# EAGLE design RPi-ILDA_v1 (EAGLE 6.4)
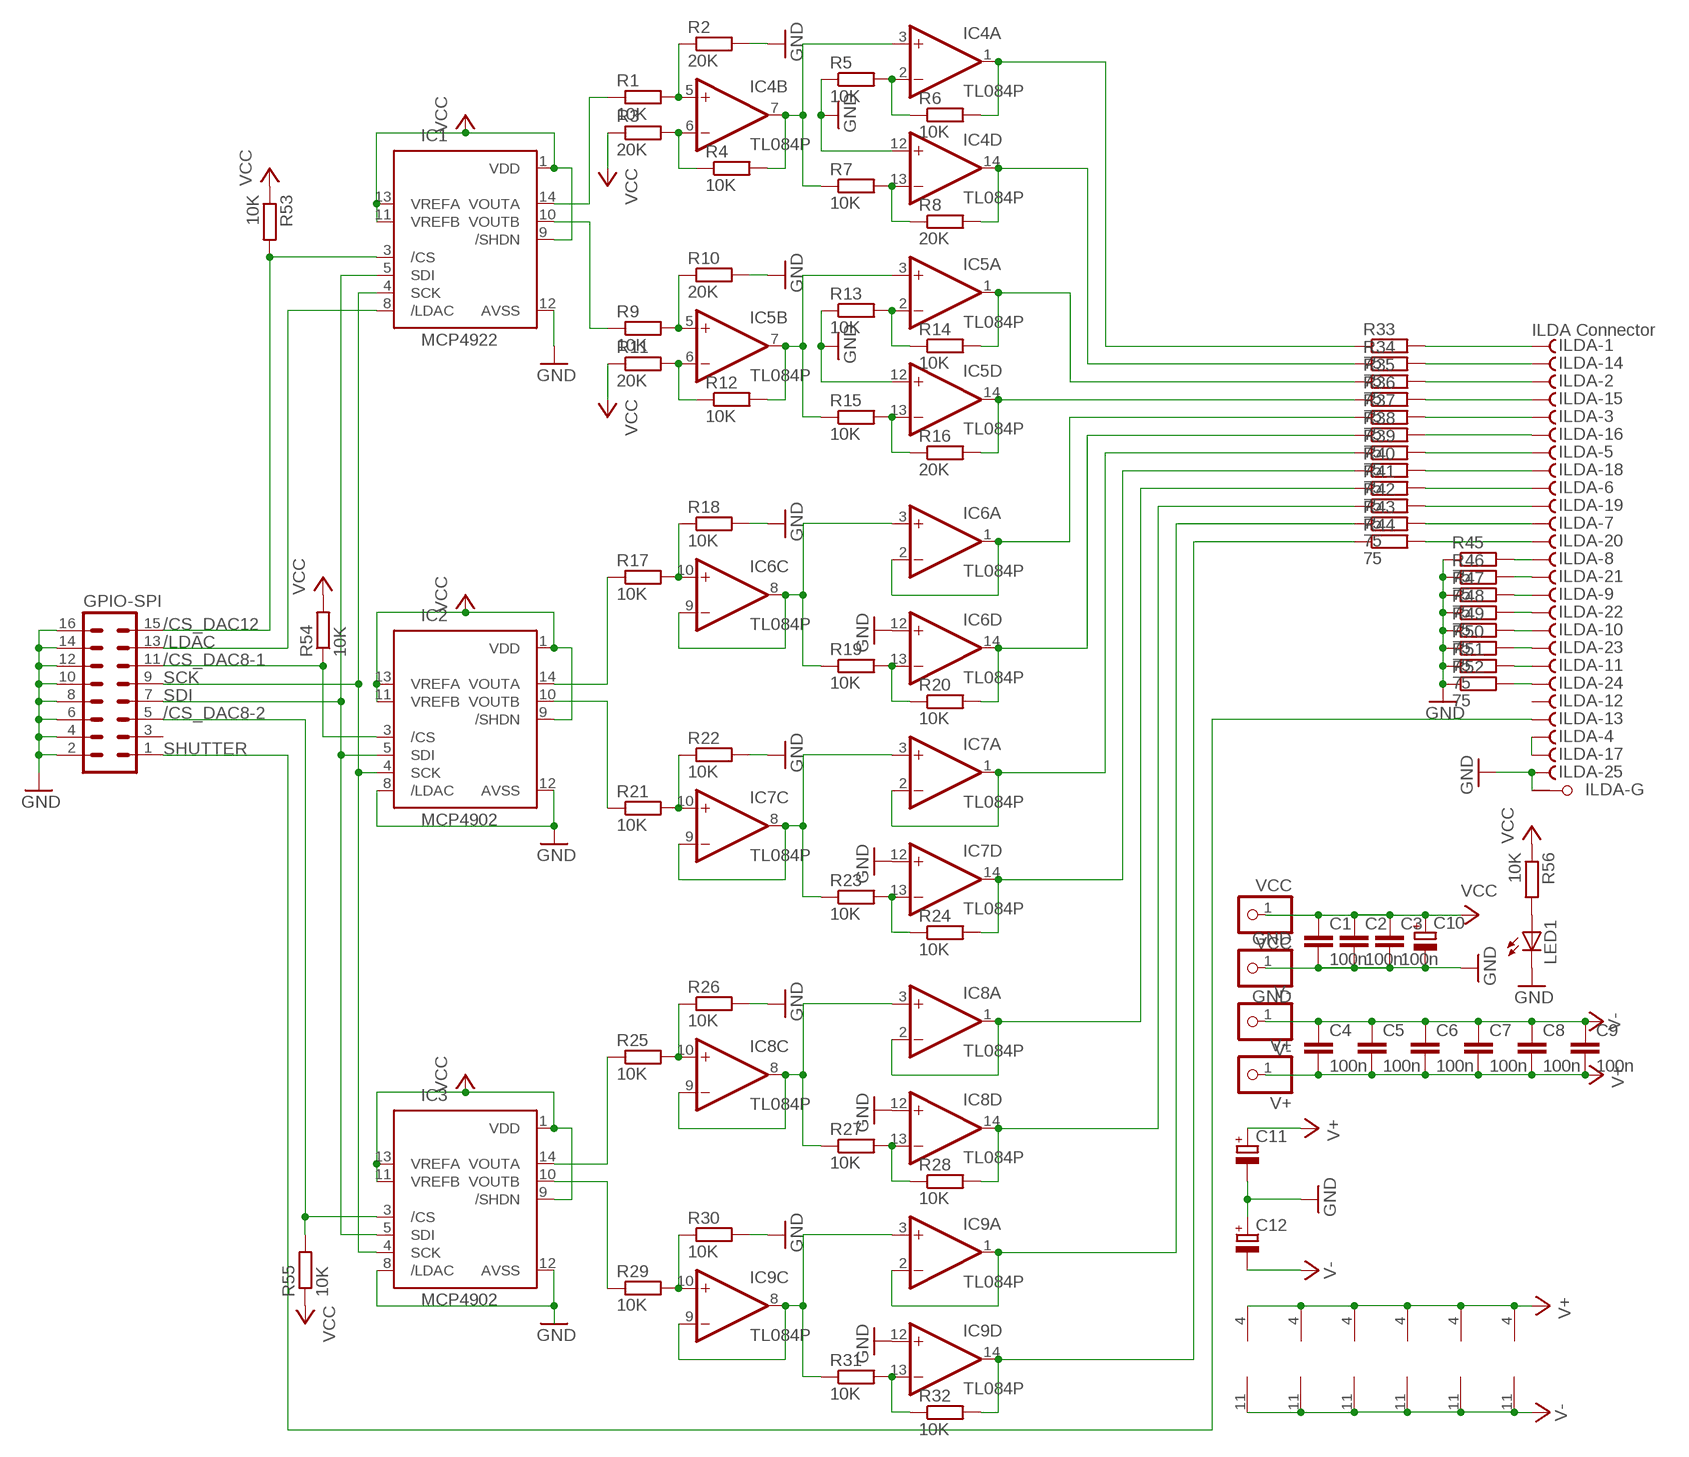
[diagram p0: schematic, sheet 1]

## Parts
C1  100n  C-EU050-024X044  [C050-024X044]
C2  100n  C-EU050-024X044  [C050-024X044]
C3  100n  C-EU050-024X044  [C050-024X044]
C4  100n  C-EU050-024X044  [C050-024X044]
C5  100n  C-EU050-024X044  [C050-024X044]
C6  100n  C-EU050-024X044  [C050-024X044]
C7  100n  C-EU050-024X044  [C050-024X044]
C8  100n  C-EU050-024X044  [C050-024X044]
C9  100n  C-EU050-024X044  [C050-024X044]
C10  CPOL-EUE5-6  [E5-6]
C11  CPOL-EUE5-6  [E5-6]
C12  CPOL-EUE5-6  [E5-6]
GND  GND  PINHD-1X1  [1X01]
GPIO-SPI  MA08-2  [MA08-2]
IC1  MCP4922  [DIL14]
IC2  MCP4902  MCP4922  [DIL14]
IC3  MCP4902  MCP4922  [DIL14]
IC4  TL084P  [DIL14]
IC5  TL084P  [DIL14]
IC6  TL084P  [DIL14]
IC7  TL084P  [DIL14]
IC8  TL084P  [DIL14]
IC9  TL084P  [DIL14]
ILDA  ILDA Connector  F25HPS  [F25HP]
LED1  LED3MM  [LED3MM]
R1  10K  R-EU_0204/5  [0204/5]
R2  20K  R-EU_0204/2V  [0204V]
R3  20K  R-EU_0204/5  [0204/5]
R4  10K  R-EU_0204/2V  [0204V]
R5  10K  R-EU_0204/2V  [0204V]
R6  10K  R-EU_0204/2V  [0204V]
R7  10K  R-EU_0204/5  [0204/5]
R8  20K  R-EU_0204/2V  [0204V]
R9  10K  R-EU_0204/5  [0204/5]
R10  20K  R-EU_0204/2V  [0204V]
R11  20K  R-EU_0204/5  [0204/5]
R12  10K  R-EU_0204/2V  [0204V]
R13  10K  R-EU_0204/2V  [0204V]
R14  10K  R-EU_0204/2V  [0204V]
R15  10K  R-EU_0204/5  [0204/5]
R16  20K  R-EU_0204/2V  [0204V]
R17  10K  R-EU_0204/5  [0204/5]
R18  10K  R-EU_0204/2V  [0204V]
R19  10K  R-EU_0204/2V  [0204V]
R20  10K  R-EU_0204/2V  [0204V]
R21  10K  R-EU_0204/5  [0204/5]
R22  10K  R-EU_0204/5  [0204/5]
R23  10K  R-EU_0204/2V  [0204V]
R24  10K  R-EU_0204/2V  [0204V]
R25  10K  R-EU_0204/5  [0204/5]
R26  10K  R-EU_0204/2V  [0204V]
R27  10K  R-EU_0204/2V  [0204V]
R28  10K  R-EU_0204/2V  [0204V]
R29  10K  R-EU_0204/5  [0204/5]
R30  10K  R-EU_0204/5  [0204/5]
R31  10K  R-EU_0204/2V  [0204V]
R32  10K  R-EU_0204/2V  [0204V]
R33  75  R-EU_0204/2V  [0204V]
R34  75  R-EU_0204/2V  [0204V]
R35  75  R-EU_0204/2V  [0204V]
R36  75  R-EU_0204/2V  [0204V]
R37  75  R-EU_0204/2V  [0204V]
R38  75  R-EU_0204/2V  [0204V]
R39  75  R-EU_0204/2V  [0204V]
R40  75  R-EU_0204/2V  [0204V]
R41  75  R-EU_0204/2V  [0204V]
R42  75  R-EU_0204/2V  [0204V]
R43  75  R-EU_0204/2V  [0204V]
R44  75  R-EU_0204/2V  [0204V]
R45  75  R-EU_0204/2V  [0204V]
R46  75  R-EU_0204/2V  [0204V]
R47  75  R-EU_0204/2V  [0204V]
R48  75  R-EU_0204/2V  [0204V]
R49  75  R-EU_0204/2V  [0204V]
R50  75  R-EU_0204/2V  [0204V]
R51  75  R-EU_0204/2V  [0204V]
R52  75  R-EU_0204/2V  [0204V]
R53  10K  R-EU_0204/5  [0204/5]
R54  10K  R-EU_0204/5  [0204/5]
R55  10K  R-EU_0204/5  [0204/5]
R56  10K  R-EU_0204/2V  [0204V]
V+  V+  PINHD-1X1  [1X01]
V-  V-  PINHD-1X1  [1X01]
VCC  VCC  PINHD-1X1  [1X01]

## Nets
/CS_DAC8-1: GPIO-SPI.11 IC2.3(/CS) R54.1
/CS_DAC8-2: GPIO-SPI.5 IC3.3(/CS) R55.2
/CS_DAC12: GPIO-SPI.15 IC1.3(/CS) R53.2
/LDAC: GPIO-SPI.13 IC1.8(/LDAC)
GND: C1.2 C2.2 C3.2 C10.- C11.- C12.+ GND.1 GPIO-SPI.2 GPIO-SPI.4 GPIO-SPI.6 GPIO-SPI.8 GPIO-SPI.10 GPIO-SPI.12 GPIO-SPI.14 GPIO-SPI.16 IC1.12(AVSS) IC2.8(/LDAC) IC2.12(AVSS) IC3.8(/LDAC) IC3.12(AVSS) IC4.12(D:+IN) IC5.12(D:+IN) IC6.12(D:+IN) IC7.12(D:+IN) IC8.12(D:+IN) IC9.12(D:+IN) ILDA.25(-25:F) ILDA.G1(-G:G1) LED1.K(C) R2.2 R5.1 R10.2 R13.1 R18.2 R22.2 R26.2 R30.2 R45.1 R46.1 R47.1 R48.1 R49.1 R50.1 R51.1 R52.1
N$1: LED1.A R56.2
N$2: ILDA.3(-3:F) R37.2
N$3: IC4.2(A:-IN) R5.2 R6.1
N$4: IC5.2(A:-IN) R13.2 R14.1
N$5: IC5.13(D:-IN) R15.2 R16.1
N$6: IC3.14(VOUTA) R25.1
N$7: IC7.14(D:OUT) R24.2 R40.1
N$8: IC7.13(D:-IN) R23.2 R24.1
N$9: IC7.10(C:+IN) R21.2 R22.1
N$10: ILDA.4(-4:F) ILDA.17(-17:F)
N$11: IC7.3(A:+IN) IC7.8(C:OUT) IC7.9(C:-IN) R23.1
N$12: IC7.1(A:OUT) IC7.2(A:-IN) R39.1
N$15: ILDA.5(-5:F) R39.2
N$16: IC1.14(VOUTA) R1.1
N$17: IC1.10(VOUTB) R9.1
N$18: ILDA.18(-18:F) R40.2
N$20: IC6.14(D:OUT) R20.2 R38.1
N$21: IC4.13(D:-IN) R7.2 R8.1
N$22: IC6.13(D:-IN) R19.2 R20.1
N$23: IC8.14(D:OUT) R28.2 R42.1
N$24: IC6.10(C:+IN) R17.2 R18.1
N$25: IC6.3(A:+IN) IC6.8(C:OUT) IC6.9(C:-IN) R19.1
N$26: IC6.1(A:OUT) IC6.2(A:-IN) R37.1
N$27: IC8.13(D:-IN) R27.2 R28.1
N$28: IC8.10(C:+IN) R25.2 R26.1
N$29: IC8.3(A:+IN) IC8.8(C:OUT) IC8.9(C:-IN) R27.1
N$30: IC8.1(A:OUT) IC8.2(A:-IN) R41.1
N$33: ILDA.8(-8:F) R45.2
N$34: ILDA.6(-6:F) R41.2
N$35: ILDA.16(-16:F) R38.2
N$37: IC5.14(D:OUT) R16.2 R36.1
N$38: ILDA.19(-19:F) R42.2
N$39: IC5.1(A:OUT) R14.2 R35.1
N$40: IC9.14(D:OUT) R32.2 R44.1
N$41: IC9.13(D:-IN) R31.2 R32.1
N$42: IC9.10(C:+IN) R29.2 R30.1
N$43: IC9.3(A:+IN) IC9.8(C:OUT) IC9.9(C:-IN) R31.1
N$44: IC9.1(A:OUT) IC9.2(A:-IN) R43.1
N$45: IC3.10(VOUTB) R29.1
N$47: IC4.14(D:OUT) R8.2 R34.1
N$48: IC4.1(A:OUT) R6.2 R33.1
N$49: IC5.3(A:+IN) IC5.7(B:OUT) R12.2 R15.1
N$50: IC4.6(B:-IN) R3.2 R4.1
N$51: IC5.6(B:-IN) R11.2 R12.1
N$52: ILDA.7(-7:F) R43.2
N$53: ILDA.20(-20:F) R44.2
N$54: ILDA.21(-21:F) R46.2
N$55: ILDA.9(-9:F) R47.2
N$56: ILDA.22(-22:F) R48.2
N$57: ILDA.10(-10:F) R49.2
N$58: ILDA.23(-23:F) R50.2
N$59: IC2.14(VOUTA) R17.1
N$60: ILDA.11(-11:F) R51.2
N$61: ILDA.24(-24:F) R52.2
N$62: IC2.10(VOUTB) R21.1
N$63: IC5.5(B:+IN) R9.2 R10.1
N$64: IC4.5(B:+IN) R1.2 R2.1
N$85: IC4.3(A:+IN) IC4.7(B:OUT) R4.2 R7.1
N$91: ILDA.1(-1:F) R33.2
N$92: ILDA.14(-14:F) R34.2
N$93: ILDA.15(-15:F) R36.2
N$94: ILDA.2(-2:F) R35.2
SCK: GPIO-SPI.9 IC1.4(SCK) IC2.4(SCK) IC3.4(SCK)
SDI: GPIO-SPI.7 IC1.5(SDI) IC2.5(SDI) IC3.5(SDI)
SHUTTER: GPIO-SPI.1 ILDA.13(-13:F)
V+: C4.2 C5.2 C6.2 C7.2 C8.2 C9.2 C11.+ IC4.4(P:V+) IC5.4(P:V+) IC6.4(P:V+) IC7.4(P:V+) IC8.4(P:V+) IC9.4(P:V+) V+.1
V-: C4.1 C5.1 C6.1 C7.1 C8.1 C9.1 C12.- IC4.11(P:V-) IC5.11(P:V-) IC6.11(P:V-) IC7.11(P:V-) IC8.11(P:V-) IC9.11(P:V-) V-.1
VCC: C1.1 C2.1 C3.1 C10.+ IC1.1(VDD) IC1.9(/SHDN) IC1.11(VREFB) IC1.13(VREFA) IC2.1(VDD) IC2.9(/SHDN) IC2.11(VREFB) IC2.13(VREFA) IC3.1(VDD) IC3.9(/SHDN) IC3.11(VREFB) IC3.13(VREFA) R3.1 R11.1 R53.1 R54.2 R55.1 R56.1 VCC.1
Unconnected: GPIO-SPI.3 IC4.8(C:OUT) IC4.9(C:-IN) IC4.10(C:+IN) IC5.8(C:OUT) IC5.9(C:-IN) IC5.10(C:+IN) IC6.5(B:+IN) IC6.6(B:-IN) IC6.7(B:OUT) IC7.5(B:+IN) IC7.6(B:-IN) IC7.7(B:OUT) IC8.5(B:+IN) IC8.6(B:-IN) IC8.7(B:OUT) IC9.5(B:+IN) IC9.6(B:-IN) IC9.7(B:OUT) ILDA.12(-12:F) ILDA.G2(-G:G2)

## Library data of the parts
C1-C9 = rcl:C-EU: CAPACITOR, European symbol
C10-C12 = rcl:CPOL-EU: POLARIZED CAPACITOR, European symbol
GND V+ V- VCC = pinhead:PINHD-1X1: PIN HEADER
GPIO-SPI = con-lstb:MA08-2: PIN HEADER; OC_FARNELL: unknown; OC_NEWARK: unknown
IC1-IC3 = Peripherals:MCP4922: 12-Bit DAC with SPI Interface
IC4-IC9 = linear:TL084: OP AMP
ILDA = con-subd:F25HPS: SUB-D; OC_FARNELL: unknown; OC_NEWARK: unknown
LED1 = led:LED: LED OSRAM: - CHIPLED LG R971, LG N971, LY N971, LG Q971, LY Q971, LO R971, LY R971 LH N974, LH R974 LS Q976, LO Q976, LY Q976 LO Q996 - Hyper CHIPLED LW Q18S LB Q993, LB Q99A, LB R99A - SideLED LS A670, LO A670, LY A670, LG A670, LP A670 LB A673, LV A673, LT A673, LW A673 LH A674 LY A675 LS A676, LA A676, LO A676, LY A676, LW A676 LS A679, LY A679, LG A679 - Hyper Micro SIDELED® LS Y876, LA Y876, LO Y876, LY Y876 LT Y87S - SmartLED LW L88C, LW L88S LB L89C, LB L89S, LG L890 LS L89K, LO L89K, LY L89K LS L896, LA L896, LO L896, LY L896 - TOPLED LS T670, LO T670, LY T670, LG T670, LP T670 LSG T670, LSP T670, LSY T670, LOP T670, LYG T670 LG T671, LOG T671, LSG T671 LB T673, LV T673, LT T673, LW T673 LH T674 LS T676, LA T676, LO T676, LY T676, LB T676, LH T676, LSB T676, LW T676 LB T67C, LV T67C, LT T67C, LS T67K, LO T67K, LY T67K, LW E67C LS E67B, LA E67B, LO E67B, LY E67B, LB E67C, LV E67C, LT E67C LW T67C LS T679, LY T679, LG T679 LS T770, LO T770, LY T770, LG T770, LP T770 LB T773, LV T773, LT T773, LW T773 LH T774 LS E675, LA E675, LY E675, LS T675 LS T776, LA T776, LO T776, LY T776, LB T776 LHGB T686 LT T68C, LB T68C - Hyper Mini TOPLED® LB M676 - Mini TOPLED Santana® LG M470 LS M47K, LO M47K, LY M47K Source: http://www.osram.convergy.de LUXEON: - LUMILED® LXK2-PW12-R00, LXK2-PW12-S00, LXK2-PW14-U00, LXK2-PW14-V00 LXK2-PM12-R00, LXK2-PM12-S00, LXK2-PM14-U00 LXK2-PE12-Q00, LXK2-PE12-R00, LXK2-PE12-S00, LXK2-PE14-T00, LXK2-PE14-U00 LXK2-PB12-K00, LXK2-PB12-L00, LXK2-PB12-M00, LXK2-PB14-N00, LXK2-PB14-P00, LXK2-PB14-Q00 LXK2-PR12-L00, LXK2-PR12-M00, LXK2-PR14-Q00, LXK2-PR14-R00 LXK2-PD12-Q00, LXK2-PD12-R00, LXK2-PD12-S00 LXK2-PH12-R00, LXK2-PH12-S00 LXK2-PL12-P00, LXK2-PL12-Q00, LXK2-PL12-R00 Source: www.luxeon.com KINGBRIGHT: KA-3528ASYC Source: www.kingbright.com
R1-R56 = resistor:R-EU_: RESISTOR, European symbol

## Board
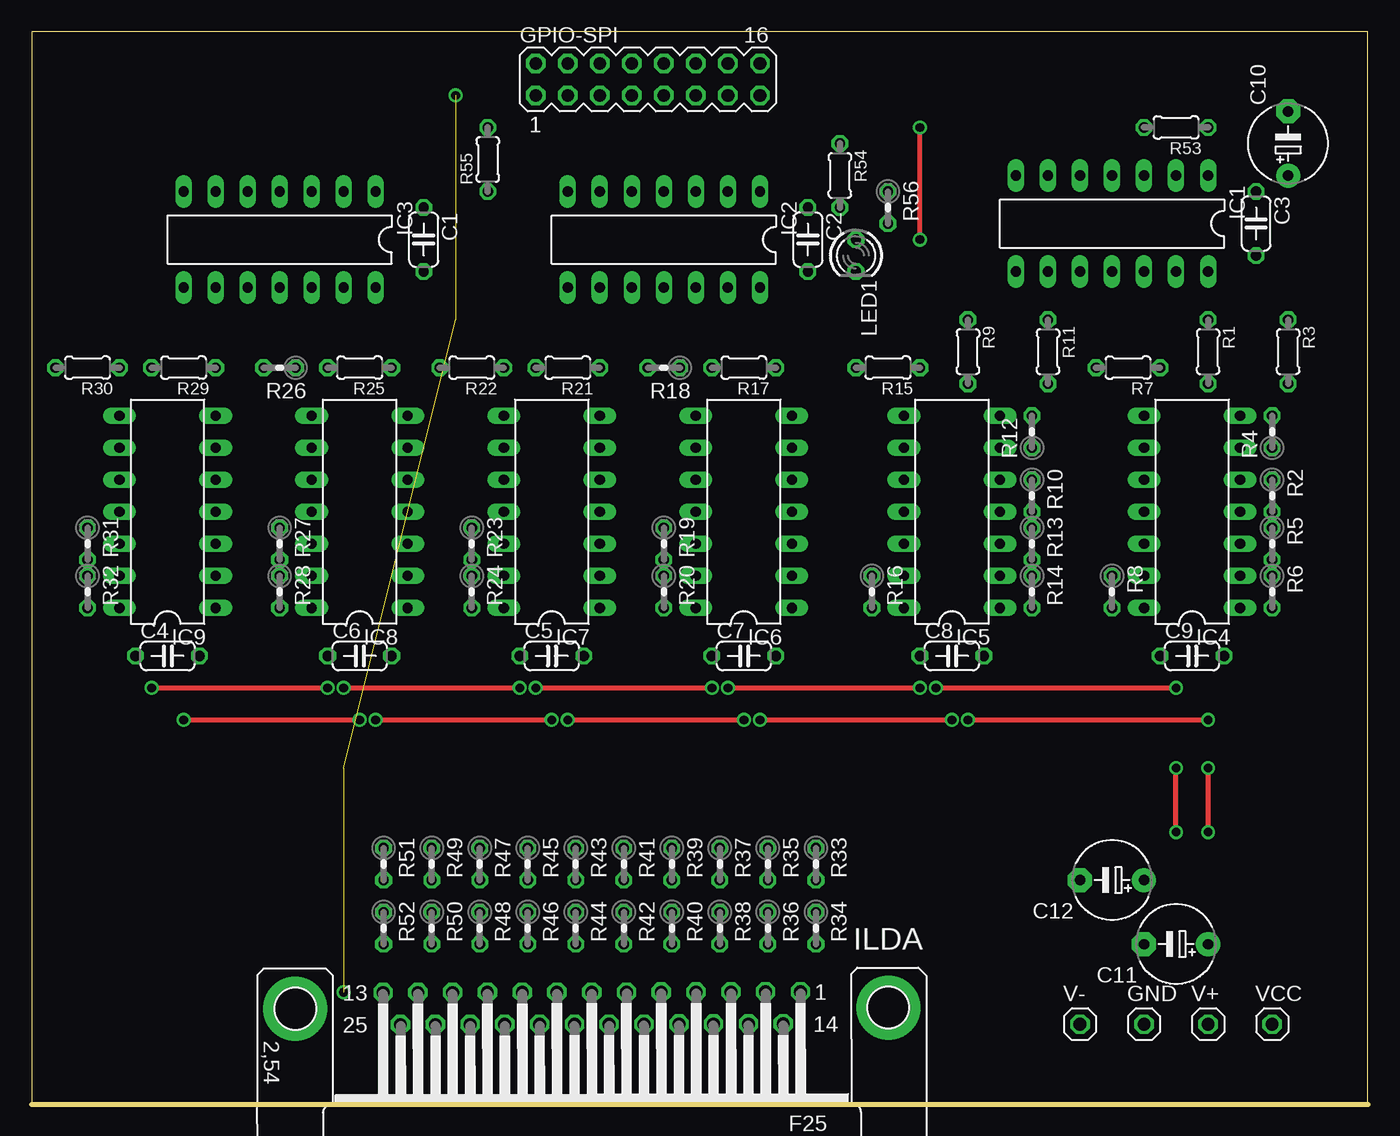
[diagram p1: board, top side]
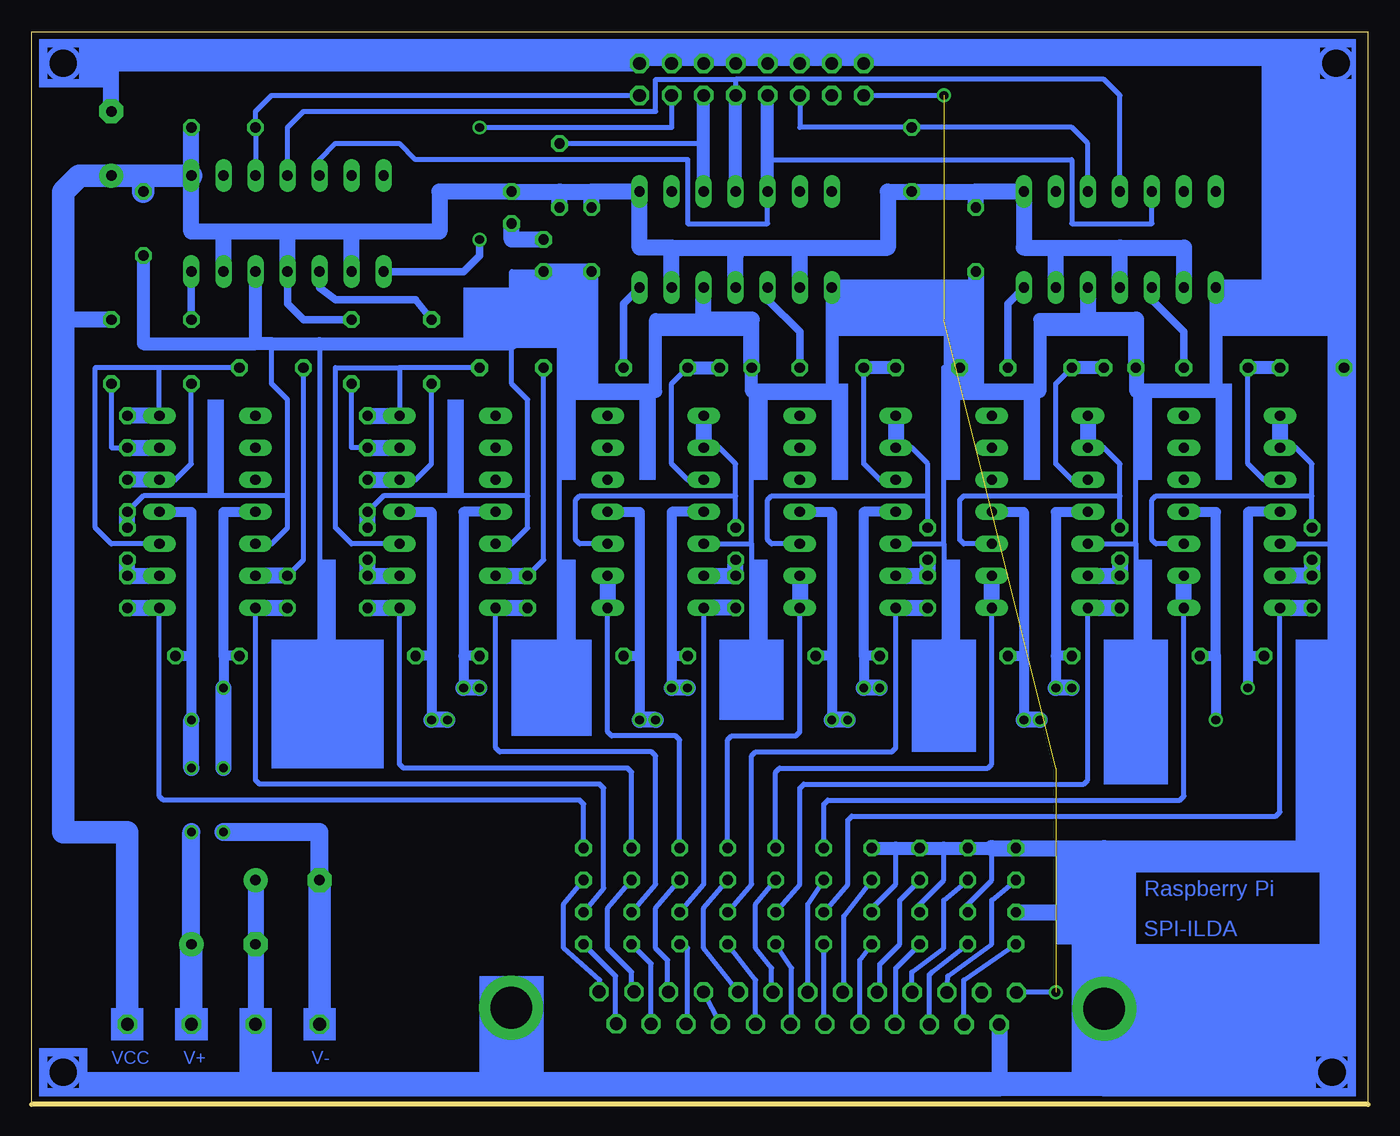
[diagram p2: board, bottom side, seen from below]

Size 106.03 x 85.08 mm. Coordinates in mm from the lower left corner, seen from the top.
Outline: 0,0 106.03,0 106.03,85.08 0,85.08 0,0
Copper layers (1*16): Top 0.035mm / dielectric 1.5mm / Bottom 0.035mm
Design rules "default": minimum track width 10mil, minimum drill 24mil, track to track 8mil, track to pad 8mil, pad to pad 8mil, via to via 8mil, smd to smd 8mil, copper to edge 40mil, drill to drill 8mil, minimum pad ring 10mil, minimum via ring 8mil, stop-mask expansion 4mil, vias tented up to drill 0mil, thermal gap 10mil

### Footprints (pad centres in the part's own frame; a part is rotated, then mirrored left to right if it is on the bottom)
C050-024X044 = drill 0.813 octagon: 1 -2.54,0; 2 2.54,0
E5-6 = drill 0.813 pad 1.905: + -2.54,0 | drill 0.813 pad 1.905 octagon: - 2.54,0
1X01 = drill 1.016 octagon: 1 0,0
MA08-2 = drill 1.016 octagon: 1 -8.89,-1.27; 2 -8.89,1.27; 3 -6.35,-1.27; 4 -6.35,1.27; 5 -3.81,-1.27; 6 -3.81,1.27; 7 -1.27,-1.27; 8 -1.27,1.27; 9 1.27,-1.27; 10 1.27,1.27; 11 3.81,-1.27; 12 3.81,1.27; 13 6.35,-1.27; 14 6.35,1.27; 15 8.89,-1.27; 16 8.89,1.27
DIL14 = drill 0.813 long: 1 -7.62,-3.81; 2 -5.08,-3.81; 3 -2.54,-3.81; 4 0,-3.81; 5 2.54,-3.81; 6 5.08,-3.81; 7 7.62,-3.81; 8 7.62,3.81; 9 5.08,3.81; 10 2.54,3.81; 11 0,3.81; 12 -2.54,3.81; 13 -5.08,3.81; 14 -7.62,3.81
F25HP = drill 1.016 octagon: 1 -16.561,-1.27; 2 -13.792,-1.27; 3 -11.049,-1.27; 4 -8.28,-1.27; 5 -5.512,-1.27; 6 -2.769,-1.27; 7 0,-1.27; 8 2.769,-1.27; 9 5.512,-1.27; 10 8.28,-1.27; 11 11.049,-1.27; 12 13.792,-1.27; 13 16.561,-1.27; 14 -15.189,1.27; 15 -12.421,1.27; 16 -9.652,1.27; 17 -6.909,1.27; 18 -4.14,1.27; 19 -1.372,1.27; 20 1.372,1.27; 21 4.14,1.27; 22 6.909,1.27; 23 9.652,1.27; 24 12.421,1.27; 25 15.189,1.27 | drill 3.302 pad 5.08: G1 -23.52,0; G2 23.52,0
LED3MM = drill 0.813 octagon: A -1.27,0; K 1.27,0
0204/5 = drill 0.813 octagon: 1 -2.54,0; 2 2.54,0
0204V = drill 0.813 octagon: 1 -1.27,0; 2 1.27,0

### Placement (x,y rotation side)
C1  31.12,68.58 270 top
C2  61.59,68.58 270 top
C3  97.16,69.85 270 top
C4  10.79,35.56 0 top
C5  41.27,35.56 0 top
C6  26.04,35.56 0 top
C7  56.52,35.56 0 top
C8  73.03,35.56 0 top
C9  92.08,35.56 0 top
C10  99.69,76.2 90 top
C11  90.8,12.7 180 top
C12  85.72,17.78 180 top
GND  88.27,6.35 0 top
GPIO-SPI  48.89,81.28 0 top
IC1  85.72,69.85 180 top
IC2  50.16,68.58 180 top
IC3  19.68,68.58 180 top
IC4  92.08,46.99 90 top
IC5  73.03,46.99 90 top
IC6  56.52,46.99 90 top
IC7  41.27,46.99 90 top
IC8  26.04,46.99 90 top
IC9  10.79,46.99 90 top
ILDA  44.45,7.62 180.1 top
LED1  65.41,67.31 270 top
R1  93.34,59.69 270 top
R2  98.42,48.26 270 top
R3  99.69,59.69 270 top
R4  98.42,53.34 90 top
R5  98.42,44.45 270 top
R6  98.42,40.64 270 top
R7  87,58.42 180 top
R8  85.72,40.64 270 top
R9  74.3,59.69 270 top
R10  79.38,48.26 270 top
R11  80.64,59.69 270 top
R12  79.38,53.34 90 top
R13  79.38,44.45 270 top
R14  79.38,40.64 270 top
R15  67.94,58.42 180 top
R16  66.67,40.64 270 top
R17  56.52,58.42 180 top
R18  50.16,58.42 180 top
R19  50.16,44.45 270 top
R20  50.16,40.64 270 top
R21  42.55,58.42 180 top
R22  34.92,58.42 180 top
R23  34.92,44.45 270 top
R24  34.92,40.64 270 top
R25  26.04,58.42 180 top
R26  19.68,58.42 180 top
R27  19.68,44.45 270 top
R28  19.68,40.64 270 top
R29  12.07,58.42 180 top
R30  4.44,58.42 180 top
R31  4.44,44.45 270 top
R32  4.44,40.64 270 top
R33  62.23,19.05 270 top
R34  62.23,13.97 270 top
R35  58.42,19.05 270 top
R36  58.42,13.97 270 top
R37  54.61,19.05 270 top
R38  54.61,13.97 270 top
R39  50.8,19.05 270 top
R40  50.8,13.97 270 top
R41  46.99,19.05 270 top
R42  46.99,13.97 270 top
R43  43.18,19.05 270 top
R44  43.18,13.97 270 top
R45  39.37,19.05 270 top
R46  39.37,13.97 270 top
R47  35.56,19.05 270 top
R48  35.56,13.97 270 top
R49  31.75,19.05 270 top
R50  31.75,13.97 270 top
R51  27.94,19.05 270 top
R52  27.94,13.97 270 top
R53  90.8,77.47 180 top
R54  64.14,73.66 270 top
R55  36.2,74.93 90 top
R56  67.94,71.12 270 top
V+  93.34,6.35 0 top
V-  83.19,6.35 0 top
VCC  98.42,6.35 0 top

### Tracks (layer width: path | path; a pad name or v marks a point on that pad's centre or on a via)
/CS_DAC8-1
  Bottom 0.406: R54.1 52.7,76.2 GPIO-SPI.11
  Bottom 1.016: IC2.3 GPIO-SPI.11
/CS_DAC8-2
  Bottom 0.406: GPIO-SPI.5 45.09,77.47 R55.2 23.49,77.47 22.22,76.2 IC3.3
/CS_DAC12
  Bottom 0.406: IC1.3 R53.2 88.27,78.74 87,80.01 GPIO-SPI.15
/LDAC  (via drill 0.7)
  Top 0.406: v70.48,68.58 v70.48,77.47
  Bottom 0.406: GPIO-SPI.13 55.24,77.47 v70.48,77.47
  Bottom 0.61: IC1.8 71.75,66.04 70.48,67.31 v70.48,68.58
GND
  Bottom 0.406: R46.1 39.37,15.56 37.46,17.46 37.46,20.32 20.95,20.32 | R48.1 35.56,15.88 33.66,17.78 33.66,20.32 | R50.1 31.75,15.88 29.84,17.78 29.84,20.32 | 10.79,64.77 IC3.8 | 3.17,44.45 IC9.12 1.91,44.45 | IC8.12 18.41,44.45 | 18.41,44.45 R26.2 | IC7.12 33.66,44.45 | IC6.12 48.89,44.45 | 48.89,44.45 48.89,56.52 | IC5.12 67.94,44.45 66.67,45.72 66.67,48.26 | 66.67,48.26 78.11,48.26 R10.2 | 66.67,48.26 66.67,55.88 67.94,57.15 67.94,60.33 67.94,66.04 LED1.K | IC4.12 87,44.45 85.72,45.72 85.72,48.26 | 85.72,48.26 97.16,48.26 R2.2 | 85.72,48.26 85.72,55.88 87,57.15 87,60.33 | GPIO-SPI.16 GPIO-SPI.14 GPIO-SPI.12 GPIO-SPI.10 GPIO-SPI.8 GPIO-SPI.6 GPIO-SPI.4 GPIO-SPI.2 | 99.69,82.55 8.26,82.55 8.26,64.77 | 18.41,44.45 18.41,36.83 | 33.66,44.45 33.66,36.83 | 48.89,44.45 48.89,36.83 | 64.14,36.83 64.14,66.04 | 83.19,60.33 83.19,36.83 | 33.66,44.45 33.66,58.42 R22.2
  Bottom 1.016: R45.1 37.46,20.32 R47.1 33.66,20.32 R49.1 29.84,20.32 R51.1 | IC2.8 42.55,56.52 48.89,56.52 R18.2 | IC3.8 12.07,56.52 18.41,56.52 R26.2 | 22.22,62.23 26.04,62.23 26.04,56.52 31.12,56.52 31.12,58.42 | C2.2 61.59,56.52 56.52,56.52 56.52,62.23 52.07,62.23 | C3.2 97.16,60.33 88.27,60.33 | 88.27,60.33 IC1.12 | 67.94,60.33 83.19,60.33 87,60.33 88.27,60.33
  Bottom 1.27: R5.1 R2.2 | R13.1 R10.2 | ILDA.25 29.26,1.27 | 20.95,15.24 20.95,1.27 29.26,1.27 | IC3.8 8.26,64.77 1.91,64.77 R30.2 1.91,44.45 1.91,21.59 3.17,20.32 20.95,20.32 | IC3.12 22.22,62.23 18.41,62.23 R26.2 | C1.2 31.12,64.77 | 31.12,64.77 31.12,58.42 R22.2 | 31.12,64.77 IC2.8 | R18.2 48.89,62.23 52.07,62.23 52.7,62.23 IC2.12 | C2.2 64.14,66.04 LED1.K | C10.- 99.69,82.55 GPIO-SPI.16 | R52.1 20.95,15.24 | 29.84,20.32 20.95,20.32 | 20.95,20.32 20.95,15.24 | GND.1 C11.- C12.+ GND.1 | GND.1 88.27,1.27 67.94,1.27 | 67.94,1.27 67.94,7.64 ILDA.G1 | 67.94,1.27 29.26,1.27
N$1
  Bottom 1.27: LED1.A 67.94,68.58 R56.2
N$2
  Bottom 0.406: ILDA.3 55.56,9.21 55.56,11.43 56.52,12.38 56.52,15.56 R37.2
N$3
  Bottom 1.27: IC4.2 R6.1 R5.2
N$4
  Bottom 1.27: IC5.2 R14.1 R13.2
N$5
  Bottom 0.406: R16.1 65.41,43.18 R15.2
  Bottom 1.27: IC5.13 R16.1
N$6
  Bottom 0.61: R25.1 28.57,63.5 IC3.14
N$7
  Bottom 0.406: R40.1 48.89,17.46 48.89,27.62 48.58,27.94 37.78,27.94 37.46,28.26 IC7.14
  Bottom 1.27: IC7.14 R24.2
N$8
  Bottom 1.27: IC7.13 R24.1 R23.2
N$9
  Bottom 0.406: IC7.10 38.73,49.53 40,50.8 R21.2
  Bottom 1.016: R22.1 R21.2
N$10
  Bottom 0.406: ILDA.17 ILDA.4
N$11
  Bottom 0.406: R23.1 34.92,48.26 | 34.92,48.26 34.92,50.8 36.2,52.07 IC7.9 | IC7.3 47.31,44.45 47.62,44.77 47.62,47.94 47.31,48.26 34.92,48.26
  Bottom 1.27: IC7.8 IC7.9
N$12
  Bottom 0.406: R39.1 50.8,28.89 50.48,29.21 45.4,29.21 45.09,29.53 IC7.1
  Bottom 1.27: IC7.2 IC7.1
N$15
  Bottom 0.406: ILDA.5 52.7,12.38 52.7,15.56 R39.2
N$16
  Bottom 0.61: R1.1 IC1.14
N$17
  Bottom 0.61: IC1.10 83.19,64.77 81.91,63.82 75.56,63.82 R9.1
N$18
  Bottom 0.406: ILDA.18 48.58,9.84 R40.2
N$20
  Bottom 0.406: R38.1 52.7,17.46 IC6.14
  Bottom 1.27: R20.2 IC6.14
N$21
  Bottom 0.406: R8.1 84.45,43.18 R7.2
  Bottom 1.27: R8.1 IC4.13
N$22
  Bottom 1.27: IC6.13 R20.1 R19.2
N$23
  Bottom 0.406: R42.1 45.09,17.46 45.09,25.08 44.77,25.4 22.54,25.4 22.22,25.72 IC8.14
  Bottom 1.27: IC8.14 R28.2
N$24
  Bottom 0.406: R17.2 55.24,57.15 55.24,50.8 53.98,49.53 IC6.10
  Bottom 1.016: R17.2 R18.1
N$25
  Bottom 0.406: R19.1 50.16,48.26 | 50.16,48.26 50.16,50.8 51.44,52.07 IC6.9 | IC6.3 62.55,44.45 62.86,44.77 62.86,47.94 62.55,48.26 50.16,48.26
  Bottom 1.27: IC6.8 IC6.9
N$26
  Bottom 0.406: R37.1 54.61,28.89 54.93,29.21 60.01,29.21 60.32,29.53 IC6.1
  Bottom 1.27: IC6.2 IC6.1
N$27
  Bottom 1.27: R27.2 R28.1 IC8.13
N$28
  Bottom 0.406: R25.2 24.77,57.15 24.77,50.8 23.49,49.53 IC8.10
  Bottom 1.016: R26.1 R25.2
N$29
  Bottom 0.406: R27.1 19.68,48.26 | 19.68,48.26 19.68,50.8 20.95,52.07 IC8.9 | IC8.3 32.07,44.45 32.38,44.77 32.38,47.94 32.07,48.26 19.68,48.26
  Bottom 1.27: IC8.8 IC8.9
N$30
  Bottom 0.406: R41.1 46.99,26.35 46.67,26.67 30.16,26.67 29.84,26.99 IC8.1
  Bottom 1.27: IC8.1 IC8.2
N$33
  Bottom 0.305: ILDA.8 41.59,9.21
  Bottom 0.406: 41.59,9.21 41.59,14.92 R45.2
N$34
  Bottom 0.406: ILDA.6 47.31,9.21 47.31,10.79 48.58,12.38 48.58,15.88 R41.2
N$35
  Bottom 0.406: ILDA.16 53.98,6.37 53.98,12.38 R38.2
N$37
  Bottom 0.406: R36.1 56.52,17.46 56.52,27.62 56.83,27.94 68.9,27.94 69.22,28.26 IC5.14
  Bottom 1.27: IC5.14 R16.2
N$38
  Bottom 0.305: ILDA.19 45.72,6.67
  Bottom 0.406: 45.72,6.67 45.72,10.79 R42.2
N$39
  Bottom 0.406: R35.1 58.42,26.35 58.74,26.67 76.52,26.67 76.83,26.99 IC5.1
  Bottom 1.27: R14.2 IC5.1
N$40
  Bottom 0.406: R44.1 41.27,17.46 41.27,22.54 40.96,22.86 7.3,22.86 6.99,23.18 IC9.14
  Bottom 1.27: IC9.14 R32.2
N$41
  Bottom 1.27: R31.2 R32.1 IC9.13
N$42
  Bottom 0.406: IC9.10 8.26,49.53 9.53,50.8 R29.2
  Bottom 1.016: R30.1 R29.2
N$43
  Bottom 0.406: R31.1 4.44,48.26 | 4.44,48.26 4.44,50.8 5.71,52.07 IC9.9 | IC9.3 16.83,44.45 17.14,44.77 17.14,47.94 16.83,48.26 4.44,48.26
  Bottom 1.27: IC9.8 IC9.9
N$44
  Bottom 0.406: R43.1 43.18,23.81 42.86,24.13 14.92,24.13 14.61,24.45 IC9.1
  Bottom 1.27: IC9.1 IC9.2
N$45
  Bottom 0.61: 17.14,63.82 14.61,61.28 R29.1
  Bottom 0.813: IC3.10 17.14,63.82
N$47
  Bottom 0.406: R34.1 60.64,17.14 60.64,25.08 60.96,25.4 87.95,25.4 88.27,25.72 IC4.14
  Bottom 1.27: IC4.14 R8.2
N$48
  Bottom 0.406: R33.1 62.23,23.81 62.55,24.13 95.57,24.13 95.89,24.45 IC4.1
  Bottom 1.27: R6.2 IC4.1
N$49
  Bottom 0.406: R15.1 76.83,58.42 | 76.83,58.42 IC5.7 | 76.83,58.42 81.91,58.42 81.91,45.72 80.64,44.45 IC5.3
  Bottom 1.27: R12.2 IC5.7
N$50
  Bottom 0.406: R3.2 99.69,52.07 R4.1
  Bottom 1.27: R4.1 IC4.6
N$51
  Bottom 0.406: R12.1 80.64,52.07 R11.2
  Bottom 1.27: R12.1 IC5.6
N$52
  Bottom 0.406: ILDA.7 44.45,15.88 R43.2
N$53
  Bottom 0.305: ILDA.20 43.18,6.67
  Bottom 0.406: 43.18,6.67 R44.2
N$54
  Bottom 0.406: ILDA.21 40.32,11.43 R46.2
N$55
  Bottom 0.305: ILDA.9 38.73,9.21
  Bottom 0.406: 38.73,9.21 38.73,11.11 37.15,12.7 37.15,16.19 R47.2
N$56
  Bottom 0.305: ILDA.22 37.46,6.35
  Bottom 0.406: 37.46,6.35 37.46,10.79 R48.2
N$57
  Bottom 0.406: ILDA.10 36.2,10.48 33.66,12.38 33.66,16.19 R49.2
N$58
  Bottom 0.406: R50.2 34.61,10.48 34.8,10.29 ILDA.23
N$59
  Bottom 0.61: R17.1 59.05,63.5 IC2.14
N$60
  Bottom 0.406: ILDA.11 33.34,10.16 29.84,12.7 29.84,16.19 R51.2
N$61
  Bottom 0.406: ILDA.24 32.07,6.33 32.07,9.84 R52.2
N$62
  Bottom 0.61: 47.62,63.82 45.09,61.28 R21.1
  Bottom 0.813: IC2.10 47.62,63.82
N$63
  Bottom 0.406: IC5.5 75.56,49.53 74.3,50.8 R9.2
  Bottom 1.27: R10.1 IC5.5
N$64
  Bottom 0.406: IC4.5 94.61,49.53 93.34,50.8 R1.2
  Bottom 1.27: IC4.5 R2.1
N$85
  Bottom 0.406: R7.1 95.89,58.42 | IC4.7 95.89,58.42 | 95.89,58.42 100.97,58.42 100.97,45.72 99.69,44.45 IC4.3
  Bottom 1.27: IC4.7 R4.2
N$91
  Bottom 0.406: ILDA.1 60.96,9.84 63.82,12.38 63.82,15.88 R33.2
N$92
  Bottom 0.406: ILDA.14 59.69,6.67 59.69,10.16 R34.2
N$93
  Bottom 0.406: ILDA.15 56.87,11.15 R36.2
N$94
  Bottom 0.305: ILDA.2 58.42,9.21
  Bottom 0.406: 58.42,9.21 58.42,10.48 60.32,12.38 60.32,15.56 R35.2
SCK
  Bottom 0.406: IC1.4 85.72,77.47 84.45,78.74 56.52,78.74 56.52,81.28 50.16,81.28 | 50.16,81.28 GPIO-SPI.9 | IC3.4 19.68,80.01 20.95,81.28 50.16,81.28
  Bottom 1.016: IC2.4 GPIO-SPI.9
SDI
  Bottom 0.406: IC2.5 47.62,69.85 53.98,69.85 53.98,74.93 75.56,74.93 76.83,76.2 81.91,76.2 83.19,74.93 IC1.5 | 47.62,74.93 23.49,74.93 23.49,69.85 17.14,69.85 IC3.5
  Bottom 1.016: GPIO-SPI.7 47.62,74.93 IC2.5
SHUTTER  (via drill 0.7)  (3 unrouted)
  Bottom 0.406: GPIO-SPI.1 v33.66,80.01 | v24.77,8.89 27.86,8.89 ILDA.13
V+  (via drill 0.7)
  Top 0.406: v93.34,21.59 v93.34,26.67 | v74.3,30.48 v93.34,30.48 | v57.78,30.48 v73.03,30.48 | v42.55,30.48 v56.52,30.48 | v27.3,30.48 v41.27,30.48 | v12.07,30.48 v26.04,30.48
  Bottom 0.813: IC4.4 93.34,46.99 93.34,35.56 | C9.2 93.34,35.56 | 74.3,35.56 C8.2 | C7.2 57.78,35.56 | C6.2 27.3,35.56 | C4.2 12.07,35.56 | 12.07,35.56 12.07,46.99 IC9.4 | IC8.4 27.3,46.99 27.3,35.56 | 57.78,35.56 57.78,46.99 IC6.4 | IC5.4 74.3,46.99 74.3,35.56 | 93.34,35.56 v93.34,30.48 | 74.3,35.56 v74.3,30.48 | 57.78,35.56 v57.78,30.48 | 42.55,35.56 42.55,46.99 IC7.4 | 42.55,35.56 C5.2 | 42.55,35.56 v42.55,30.48 | 27.3,35.56 v27.3,30.48 | 12.07,35.56 v12.07,30.48
  Bottom 1.27: v93.34,26.67 v93.34,30.48 | v73.03,30.48 v74.3,30.48 | v56.52,30.48 v57.78,30.48 | v41.27,30.48 v42.55,30.48 | v26.04,30.48 v27.3,30.48
  Bottom 1.422: C11.+ v93.34,21.59
  Bottom 1.778: V+.1 C11.+
V-  (via drill 0.7)
  Top 0.406: v90.8,21.59 v90.8,26.67 | v71.75,33.02 v90.8,33.02 | v55.24,33.02 v70.48,33.02 | v40,33.02 v53.98,33.02 | v24.77,33.02 v38.73,33.02 | v9.53,33.02 v23.49,33.02
  Bottom 0.813: 90.8,35.56 90.8,46.99 IC4.11 | C9.1 90.8,35.56 | 9.53,35.56 9.53,46.99 IC9.11 | 9.53,35.56 C4.1 | C6.1 24.77,35.56 | IC8.11 24.77,46.99 24.77,35.56 | 90.8,35.56 v90.8,33.02 | IC5.11 71.75,46.99 71.75,35.56 | C8.1 71.75,35.56 | 71.75,35.56 v71.75,33.02 | 55.24,35.56 55.24,46.99 IC6.11 | 55.24,35.56 C7.1 | 55.24,35.56 v55.24,33.02 | C5.1 40,35.56 | 40,35.56 40,46.99 IC7.11 | 40,35.56 v40,33.02 | 24.77,35.56 v24.77,33.02 | 9.53,35.56 v9.53,33.02
  Bottom 1.27: v90.8,26.67 v90.8,33.02 | v70.48,33.02 v71.75,33.02 | v53.98,33.02 v55.24,33.02 | v38.73,33.02 v40,33.02 | v23.49,33.02 v24.77,33.02
  Bottom 1.422: C12.- 83.19,21.59 v90.8,21.59
  Bottom 1.778: V-.1 C12.-
VCC
  Bottom 0.61: R11.1 84.45,62.23 85.72,63.5 IC1.11
  Bottom 1.016: 38.1,67.94 45.09,67.94 | 45.09,67.94 50.16,67.94 | 50.16,67.31 50.16,67.94 | 50.16,67.94 55.24,67.94 55.24,67.63 | 27.3,67.94 24.77,67.94 | IC3.13 24.77,67.63 24.77,67.94 | 24.77,67.94 19.68,67.94 | IC3.9 14.61,67.94 | 45.09,67.63 45.09,67.94 | 80.64,68.58 80.64,69.21
  Bottom 1.27: C1.1 31.12,72.39 | 61.59,72.39 IC2.1 57.78,67.94 55.24,67.94 38.1,67.94 38.1,72.39 R55.1 31.12,72.39 | C2.1 61.59,72.39 | 85.72,69.21 80.64,69.21 73.66,69.21 73.66,72.39 R56.1 64.14,72.39 | IC1.11 85.72,69.21 | 85.72,69.21 90.8,69.21 | IC1.13 90.8,69.21 | 90.8,69.21 93.34,69.21 IC1.1 R53.1 | 64.14,72.39 61.59,72.39 | 19.68,67.94 27.3,67.94 IC3.1 31.12,72.39 | 19.68,67.94 14.61,67.94 14.61,64.45 | IC3.11 19.68,67.94 | 24.77,64.45 24.77,67.63 | IC2.9 45.09,67.63 | IC2.11 50.16,67.31 | IC2.13 55.24,67.63 | IC1.9 80.64,68.58 | R54.2 64.14,72.39 | R3.1 103.5,62.23
  Bottom 1.778: 97.16,73.66 C10.+ 102.23,73.66 103.5,72.39 103.5,62.23 103.5,21.59 98.42,21.59 VCC.1 | C3.1 97.16,73.66 | 97.16,73.66 IC1.1
(copper drawn outside any net)
  shapes: Bottom area x89, Bottom circle x4

### Text on the board
Bottom: Raspberry Pi | SPI-ILDA | V- | V+ | VCC